# EAGLE design TestBoard (EAGLE 9.6.2)
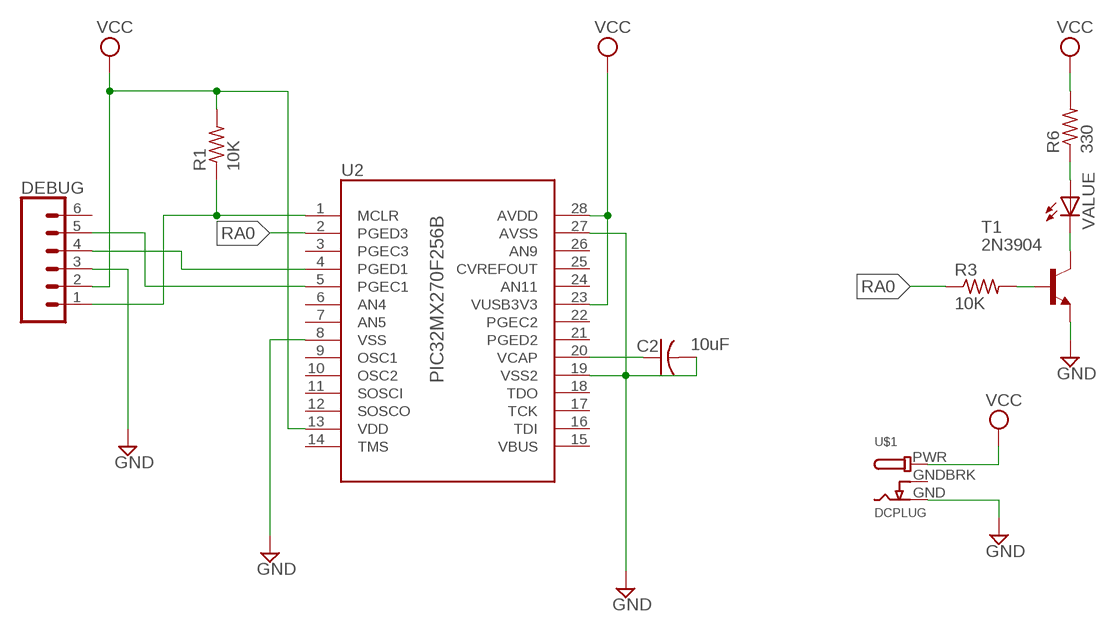
[diagram p0: schematic, sheet 1]

## Parts
C2  10uF  C-US050-024X044  [C050-024X044]
DEBUG  CONN_06LONGPADS  [1X06_LONGPADS]
R1  10K  R-US_0207/10  [0207/10]
R3  10K  R-US_0309/10  [0309/10]
R6  330  R-US_0309/10  [0309/10]
T1  2N3904  [TO92]
U2  PIC32MX270F256B  [DIP28]
U$1  DCPLUG  [POWER_JACK_SLOT]
VALUE  LED5MM  [LED5MM]

## Nets
GND: C2.2 DEBUG.3 T1.3(E) U2.8(VSS) U2.19(VSS2) U2.27(AVSS) U$1.GND
N$1: DEBUG.1 R1.1 U2.1(MCLR)
N$2: C2.1 U2.20(VCAP)
N$4: DEBUG.4 U2.4(PGED1)
N$5: DEBUG.5 U2.5(PGEC1)
N$6: R3.2 T1.2(B)
N$7: T1.1(C) VALUE.K(C)
N$8: R6.1 VALUE.A
RA0: R3.1 U2.2(PGED3)
VCC: DEBUG.2 R1.2 R6.2 U2.13(VDD) U2.23(VUSB3V3) U2.28(AVDD) U$1.PWR
Unconnected: DEBUG.6 U2.3(PGEC3) U2.6(AN4) U2.7(AN5) U2.9(OSC1) U2.10(OSC2) U2.11(SOSCI) U2.12(SOSCO) U2.14(TMS) U2.15(VBUS) U2.16(TDI) U2.17(TCK) U2.18(TDO) U2.21(PGED2) U2.22(PGEC2) U2.24(AN11) U2.25(CVREFOUT) U2.26(AN9)

## Power pins joined to a net without a drawn wire
GNDBREAK: U$1.GNDBRK(GNDBREAK)

## Library data of the parts
C2 = adafruit:C-US: CAPACITOR, American symbol
DEBUG = SparkFun-Connectors:CONN_06: Multi connection point. Often used as Generic Header-pin footprint for 0.1 inch spaced/style header connections On any of the 0.1 inch spaced packages, you can populate with these: Break Away Headers - Straight <https://www.sparkfun.com/products/116> (PRT-00116) Break Away Male Headers - Right Angle <https://www.sparkfun.com/products/553> (PRT-00553) Female Headers <https://www.sparkfun.com/products/115> (PRT-00115) Break Away Headers - Machine Pin <https://www.sparkfun.com/products/117> (PRT-00117) Break Away Female Headers - Swiss Machine Pin <https://www.sparkfun.com/products/743> (PRT-00743) Arduino Stackable Header - 6 Pin <https://www.sparkfun.com/products/9280> (PRT-09280) For SCREWTERMINALS and SPRING TERMINALS visit here: Screw Terimnals on SparkFun.com <https://www.sparkfun.com/search/results?term=Screw+Terminals> (5mm/3.5mm/2.54mm spacing) This device is also useful as a general connection point to wire up your design to another part of your project. Our various solder wires solder well into these plated through hole pads. Hook-Up Wire - Assortment (Stranded, 22 AWG) <https://www.sparkfun.com/products/11375> (PRT-11375) Hook-Up Wire - Assortment (Solid Core, 22 AWG) <https://www.sparkfun.com/products/11367> (PRT-11367) View the entire wire category on our website here <https://www.sparkfun.com/categories/141>
R1 R3 R6 = resistor:R-US_: RESISTOR, American symbol
T1 = transistor:2N3904: NPN TRANSISTOR
U2 = my_parts:PIC32MX270F256B
U$1 = my_parts:DCPLUG
VALUE = led:LED: LED OSRAM: - CHIPLED LG R971, LG N971, LY N971, LG Q971, LY Q971, LO R971, LY R971 LH N974, LH R974 LS Q976, LO Q976, LY Q976 LO Q996 - Hyper CHIPLED LW Q18S LB Q993, LB Q99A, LB R99A - SideLED LS A670, LO A670, LY A670, LG A670, LP A670 LB A673, LV A673, LT A673, LW A673 LH A674 LY A675 LS A676, LA A676, LO A676, LY A676, LW A676 LS A679, LY A679, LG A679 - Hyper Micro SIDELED® LS Y876, LA Y876, LO Y876, LY Y876 LT Y87S - SmartLED LW L88C, LW L88S LB L89C, LB L89S, LG L890 LS L89K, LO L89K, LY L89K LS L896, LA L896, LO L896, LY L896 - TOPLED LS T670, LO T670, LY T670, LG T670, LP T670 LSG T670, LSP T670, LSY T670, LOP T670, LYG T670 LG T671, LOG T671, LSG T671 LB T673, LV T673, LT T673, LW T673 LH T674 LS T676, LA T676, LO T676, LY T676, LB T676, LH T676, LSB T676, LW T676 LB T67C, LV T67C, LT T67C, LS T67K, LO T67K, LY T67K, LW E67C LS E67B, LA E67B, LO E67B, LY E67B, LB E67C, LV E67C, LT E67C LW T67C LS T679, LY T679, LG T679 LS T770, LO T770, LY T770, LG T770, LP T770 LB T773, LV T773, LT T773, LW T773 LH T774 LS E675, LA E675, LY E675, LS T675 LS T776, LA T776, LO T776, LY T776, LB T776 LHGB T686 LT T68C, LB T68C - Hyper Mini TOPLED® LB M676 - Mini TOPLED Santana® LG M470 LS M47K, LO M47K, LY M47K Source: http://www.osram.convergy.de LUXEON: - LUMILED® LXK2-PW12-R00, LXK2-PW12-S00, LXK2-PW14-U00, LXK2-PW14-V00 LXK2-PM12-R00, LXK2-PM12-S00, LXK2-PM14-U00 LXK2-PE12-Q00, LXK2-PE12-R00, LXK2-PE12-S00, LXK2-PE14-T00, LXK2-PE14-U00 LXK2-PB12-K00, LXK2-PB12-L00, LXK2-PB12-M00, LXK2-PB14-N00, LXK2-PB14-P00, LXK2-PB14-Q00 LXK2-PR12-L00, LXK2-PR12-M00, LXK2-PR14-Q00, LXK2-PR14-R00 LXK2-PD12-Q00, LXK2-PD12-R00, LXK2-PD12-S00 LXK2-PH12-R00, LXK2-PH12-S00 LXK2-PL12-P00, LXK2-PL12-Q00, LXK2-PL12-R00 Source: www.luxeon.com KINGBRIGHT: KA-3528ASYC Source: www.kingbright.com

## Board
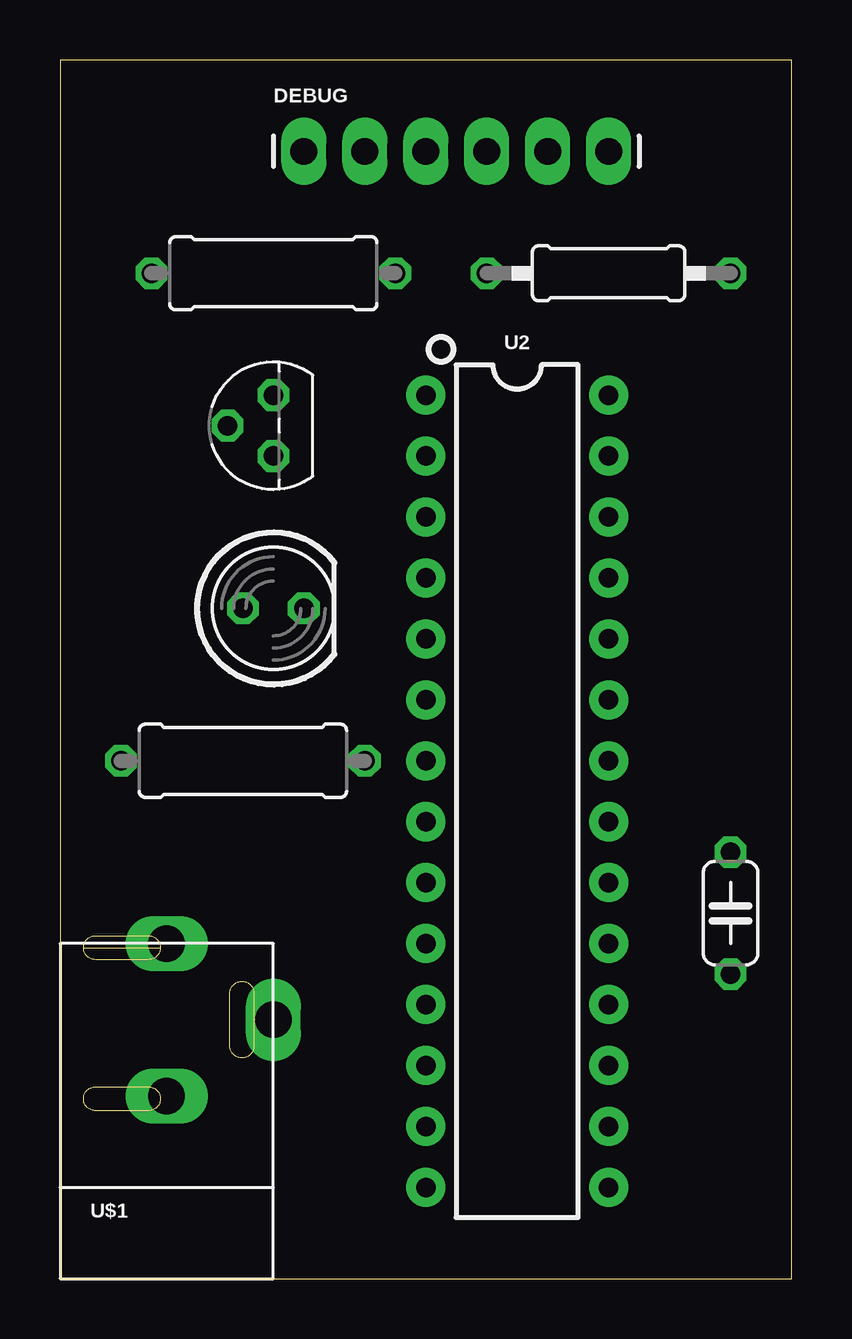
[diagram p1: board, top side]
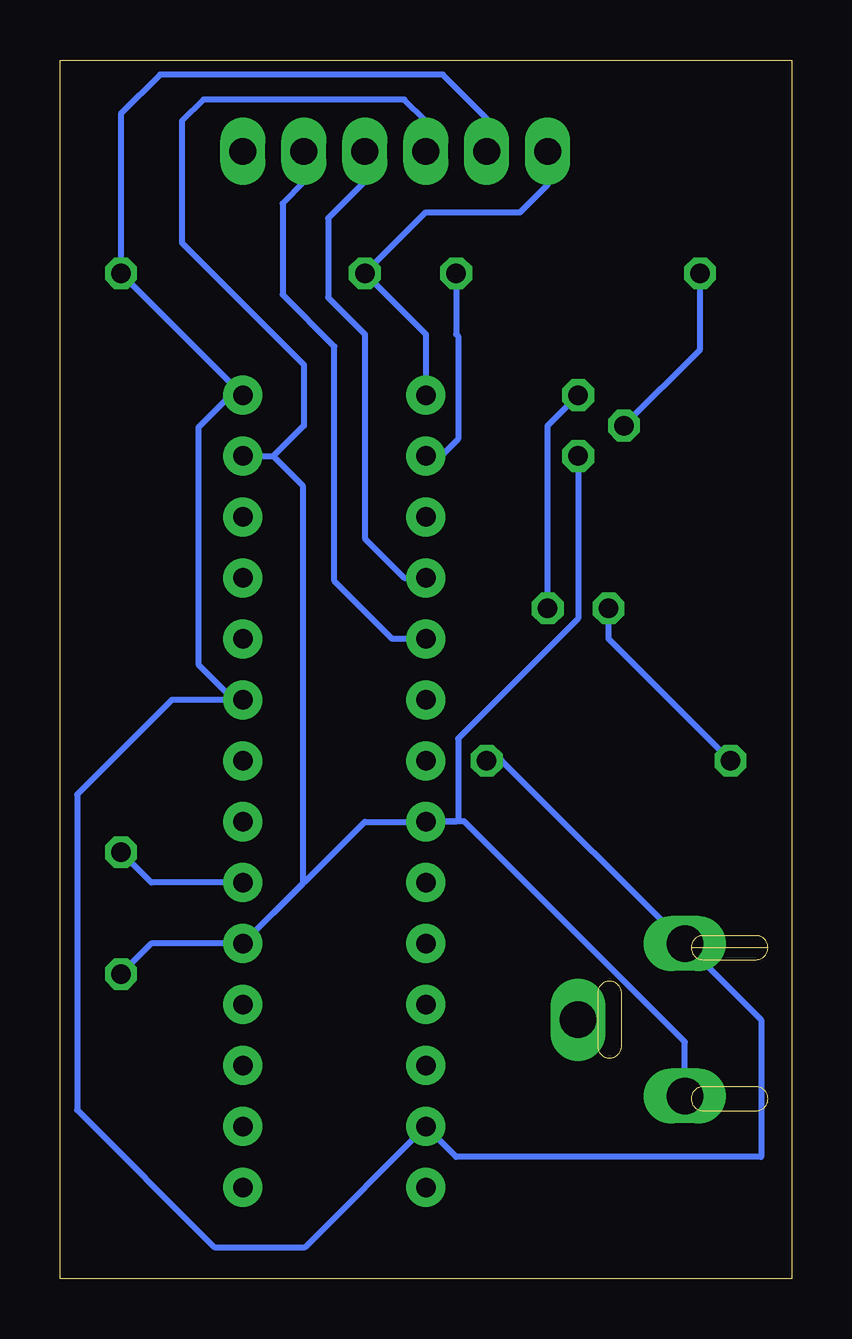
[diagram p2: board, bottom side, seen from below]

Size 30.48 x 50.8 mm. Coordinates in mm from the lower left corner, seen from the top.
Outline: 0,0 30.48,0 30.48,50.8 0,50.8 0,0
Copper layers (1*16): Top 0.035mm / dielectric 1.5mm / Bottom 0.035mm
Design rules "MyRules": minimum track width 10mil, minimum drill 0.8mm, track to track 16mil, track to pad 16mil, pad to pad 16mil, via to via 16mil, smd to smd 0mil, copper to edge 0mil, drill to drill 6mil, minimum pad ring 10mil, minimum via ring 10mil, stop-mask expansion 1mil, vias tented up to drill 30mil, thermal gap 6mil

### Footprints (pad centres in the part's own frame; a part is rotated, then mirrored left to right if it is on the bottom)
C050-024X044 = drill 0.813 octagon: 1 -2.54,0; 2 2.54,0
1X06_LONGPADS = drill 1.118 pad 1.88 long: 1 0,0; 2 2.54,0; 3 5.08,0; 4 7.62,0; 5 10.16,0; 6 12.7,0
0207/10 = drill 0.813 octagon: 1 -5.08,0; 2 5.08,0
0309/10 = drill 0.813 octagon: 1 -5.08,0; 2 5.08,0
TO92 = drill 0.813 octagon: 1 1.27,0; 2 0,1.905; 3 -1.27,0
DIP28 = drill 0.813 pad 1.626: 1 -16.51,-3.81; 2 -13.97,-3.81; 3 -11.43,-3.81; 4 -8.89,-3.81; 5 -6.35,-3.81; 6 -3.81,-3.81; 7 -1.27,-3.81; 8 1.27,-3.81; 9 3.81,-3.81; 10 6.35,-3.81; 11 8.89,-3.81; 12 11.43,-3.81; 13 13.97,-3.81; 14 16.51,-3.81; 15 16.51,3.81; 16 13.97,3.81; 17 11.43,3.81; 18 8.89,3.81; 19 6.35,3.81; 20 3.81,3.81; 21 1.27,3.81; 22 -1.27,3.81; 23 -3.81,3.81; 24 -6.35,3.81; 25 -8.89,3.81; 26 -11.43,3.81; 27 -13.97,3.81; 28 -16.51,3.81
POWER_JACK_SLOT = drill 1.524 pad 2 long: GND 4.445,7.62; GNDBRK 8.89,10.795; PWR 4.445,13.97
LED5MM = drill 0.813 octagon: A -1.27,0; K 1.27,0

### Placement (x,y rotation side)
C2  27.94,15.24 270 top
DEBUG  10.16,46.99 0 top
R1  22.86,41.91 0 top
R3  8.89,41.91 180 top
R6  7.62,21.59 0 top
T1  8.89,35.56 90 top
U2  19.05,20.32 270 top
U$1  0,0 0 top
VALUE  8.89,27.94 0 top

### Tracks (layer width: path | path; a pad name or v marks a point on that pad's centre or on a via)
GND
  Bottom 0.254: U2.19 26.67,13.97 C2.2 | DEBUG.3 15.24,48.26 16.13,49.15 24.51,49.15 25.4,48.26 25.4,43.18 20.32,38.1 20.32,35.56 21.59,34.29 | U2.27 21.59,34.29 | U2.19 17.78,19.05 U2.8 | U$1.GND 4.45,9.86 13.66,19.07 15.21,19.07 U2.8 | U2.8 13.97,19.05 13.89,19.13 13.89,22.52 8.89,27.52 T1.3 | 21.59,34.29 20.37,33.07 20.37,16.46 U2.19
N$1
  Bottom 0.254: DEBUG.1 10.16,45.59 11.3,44.45 15.24,44.45 R1.1 15.24,39.37 U2.1
N$2
  Bottom 0.254: U2.20 26.67,16.51 C2.1
N$4
  Bottom 0.254: DEBUG.4 17.78,45.72 19.3,44.2 19.3,40.89 17.78,39.37 17.78,30.86 16.13,29.21 U2.4
N$5
  Bottom 0.254: U2.5 16.64,26.67 19.05,29.08 19.05,38.86 21.21,41.02 21.21,44.83 20.32,45.72 DEBUG.5
N$6
  Bottom 0.254: T1.2 3.81,38.73 R3.2
N$7
  Bottom 0.254: VALUE.K 10.16,35.56 T1.1
N$8
  Bottom 0.254: R6.1 7.62,26.67 VALUE.A
RA0
  Bottom 0.254: R3.1 13.97,39.37 13.89,39.29 13.89,35 14.61,34.29 U2.2
VCC
  Bottom 0.254: R6.2 12.06,21.59 U$1.PWR 1.27,10.79 1.27,5.08 13.97,5.08 U2.13 20.27,1.32 24.05,1.32 29.77,7.04 29.77,20.18 25.82,24.13 U2.23 23.24,24.13 24.71,25.6 24.71,35.48 23.37,36.83 U2.28 R1.2 27.94,48.56 26.31,50.19 14.53,50.19 12.7,48.36 DEBUG.2